# EAGLE schematic Battery_Coin-Cell_CR2032_Horizontal (EAGLE 6.5.0)
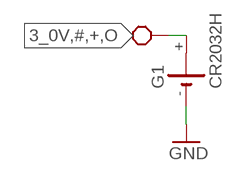
[diagram p0: schematic, sheet 1]

## Parts
G1  CR2032H  [CR2032H]

## Nets
3_0V,#,+,O: G1.+ ; supply symbol labelled BLOCK_REQUIREMENT
GND: G1.-
Unconnected: G1.+@1(+)

## Library data of the parts
G1 = battery:CR2032H: LI BATTERY Varta